# Altium schematic sheet PR2019-DataAcquisitionSystem.SchDoc: DataAcqisitionSystem
size A4; Organization: Chesi; Address1: Via Livorno, 23; Address2: 53036 Poggibonsi (SI)  - ITALY -; Address3: e-mail : andrea.chesi2000@gmail.com; DocumentNumber: 1; Revision: Rev 1.0; SheetNumber: 1; SheetTotal: 1
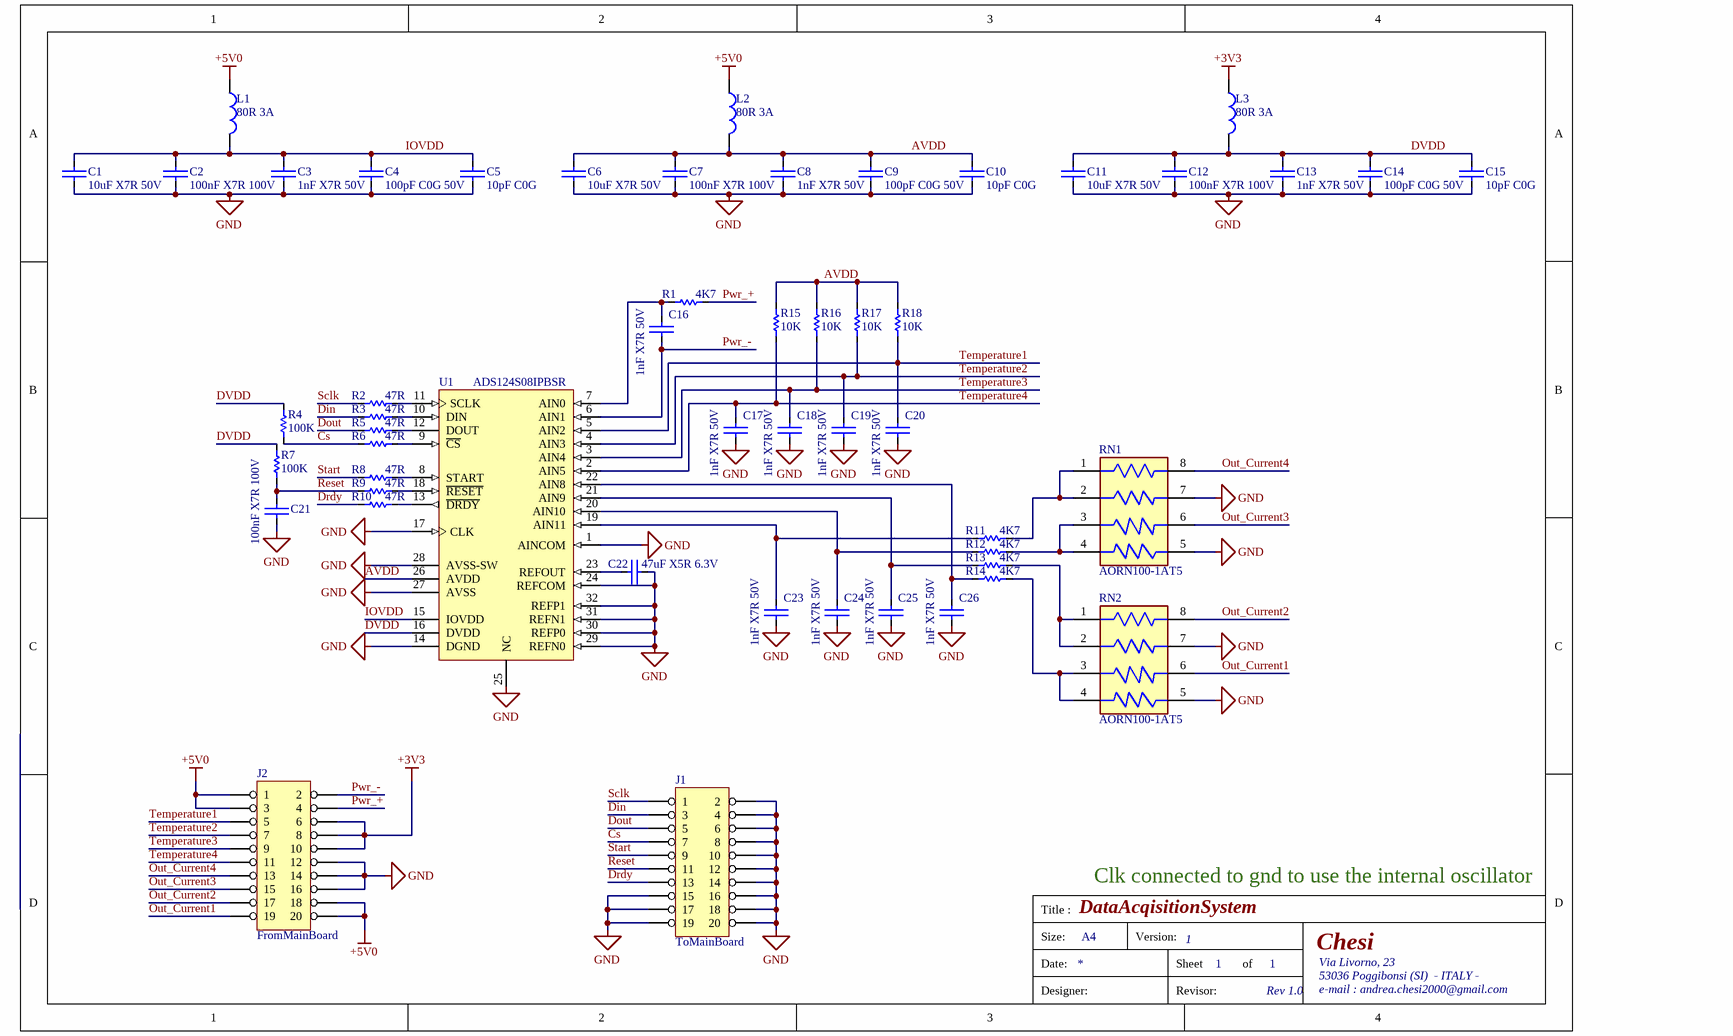
[diagram p0: PR2019-DataAcquisitionSystem.SchDoc]

## Parts
C1  10uF X7R 50V  [1206]
C2  100nF X7R 100V  [0805]
C3  1nF X7R 50V  [0805]
C4  100pF C0G 50V  [0805]
C5  10pF C0G  [0805]
C6  10uF X7R 50V  [1206]
C7  100nF X7R 100V  [0805]
C8  1nF X7R 50V  [0805]
C9  100pF C0G 50V  [0805]
C10  10pF C0G  [0805]
C11  10uF X7R 50V  [1206]
C12  100nF X7R 100V  [0805]
C13  1nF X7R 50V  [0805]
C14  100pF C0G 50V  [0805]
C15  10pF C0G  [0805]
C16  1nF X7R 50V  [0805]
C17  1nF X7R 50V  [0805]
C18  1nF X7R 50V  [0805]
C19  1nF X7R 50V  [0805]
C20  1nF X7R 50V  [0805]
C21  100nF X7R 100V  [0805]
C22  47uF X5R 6.3V  [0805]
C23  1nF X7R 50V  [0805]
C24  1nF X7R 50V  [0805]
C25  1nF X7R 50V  [0805]
C26  1nF X7R 50V  [0805]
J1  ToMainBoard  [IDC-20]
J2  FromMainBoard  [IDC-20]
L1  80R 3A  [1206]
L2  80R 3A  [1206]
L3  80R 3A  [1206]
R1  4K7  [0805]
R2  47R  [0805]
R3  47R  [0805]
R4  100K  [0805]
R5  47R  [0805]
R6  47R  [0805]
R7  100K  [0805]
R8  47R  [0805]
R9  47R  [0805]
R10  47R  [0805]
R11  4K7  [0805]
R12  4K7  [0805]
R13  4K7  [0805]
R14  4K7  [0805]
R15  10K  [0805]
R16  10K  [0805]
R17  10K  [0805]
R18  10K  [0805]
RN1  AORN100-1AT5  [FP-AORN100-1AT5-IPC_C]
RN2  AORN100-1AT5  [FP-AORN100-1AT5-IPC_C]
U1  ADS124S08IPBSR  [LQFP-32_N]

## Nets
+3V3: J2.6 J2.8 J2.10 L3.1
+5V0: J2.1 J2.3 J2.18 J2.20 L1.1 L2.1
GND: C1.2 C2.2 C3.2 C4.2 C5.2 C6.2 C7.2 C8.2 C9.2 C10.2 C11.2 C12.2 C13.2 C14.2 C15.2 C17.2 C18.2 C19.2 C20.2 C21.2 C22.2 C23.2 C24.2 C25.2 C26.2 J1.2 J1.4 J1.6 J1.8 J1.10 J1.12 J1.14 J1.15 J1.16 J1.17 J1.18 J1.19 J1.20 J2.12 J2.14 J2.16 RN1.5 RN1.7 RN2.5 RN2.7 U1.1(AINCOM) U1.14(DGND) U1.17(CLK) U1.24(REFCOM) U1.25(NC) U1.27(AVSS) U1.28(AVSS-SW) U1.29(REFN0) U1.30(REFP0) U1.31(REFN1) U1.32(REFP1)
AVDD: C6.1 C7.1 C8.1 C9.1 C10.1 L2.2 R15.1 R16.1 R17.1 R18.1 U1.26(AVDD)
Cs: J1.7 R4.2 R6.2
Din: J1.3 R3.2
Dout: J1.5 R5.2
Drdy: J1.13 R10.2
DVDD: C11.1 C12.1 C13.1 C14.1 C15.1 L3.2 R4.1 R7.1 U1.16(DVDD)
IOVDD: C1.1 C2.1 C3.1 C4.1 C5.1 L1.2 U1.15(IOVDD)
Out_Current1: J2.19 RN2.6
Out_Current2: J2.17 RN2.8
Out_Current3: J2.15 RN1.6
Out_Current4: J2.13 RN1.8
Pwr_+: J2.4 R1.1
Pwr_-: C16.2 J2.2 U1.6(AIN1)
Reset: C21.1 J1.11 R7.2 R9.2
Sclk: J1.1 R2.2
Start: J1.9 R8.2
Temperature1: C20.1 J2.5 R18.2 U1.5(AIN2)
Temperature2: C19.1 J2.7 R17.2 U1.4(AIN3)
Temperature3: C18.1 J2.9 R16.2 U1.3(AIN4)
Temperature4: C17.1 J2.11 R15.2 U1.2(AIN5)
NetC16_1: C16.1 R1.2 U1.7(AIN0)
NetC22_1: C22.1 U1.23(REFOUT)
NetC23_1: C23.1 R11.2 U1.19(AIN11)
NetC24_1: C24.1 R12.2 U1.20(AIN10)
NetC25_1: C25.1 R13.2 U1.21(AIN9)
NetC26_1: C26.1 R14.2 U1.22(AIN8)
NetR2_1: R2.1 U1.11(SCLK)
NetR3_1: R3.1 U1.10(DIN)
NetR5_1: R5.1 U1.12(DOUT)
NetR6_1: R6.1 U1.9(~{CS})
NetR8_1: R8.1 U1.8(START)
NetR9_1: R9.1 U1.18(~{RESET})
NetR10_1: R10.1 U1.13(~{DRDY})
NetR11_1: R11.1 RN1.1 RN1.2
NetR12_1: R12.1 RN1.3 RN1.4
NetR13_1: R13.1 RN2.1 RN2.2
NetR14_1: R14.1 RN2.3 RN2.4

## Notes on the sheet
- Clk connected to gnd to use the internal oscillator
- Title :
- Size:
- Date:
- A4
- Version:
- Sheet
- of
- Designer:
- Revisor:

## Library data of the parts
C1 C6 C11 = CAP_10uF X7R 50V_1206: Capacità; ArSilicii Part Number: CPC0232011; Manufacturer Part Number: CL31B106KBHNNNE; SMD/TH: SMD; 1 Supplier: ARROW ELECTRONICS ITALIA S.R.L.; 1 Supplier Part Number: CL31B106KBHNNNE; 1 Supplier Unit Price: *; 2 Supplier: *; 2 Supplier Part Number: *; 2 Supplier Unit Price: *; 3 Supplier: *; 3 Supplier Part Number: *; 3 Supplier Unit Price: *; Manufacturer: *; ComponentLink1URL: *; ComponentLink2URL: *; ComponentLink1Description: Datasheet for 10uF X7R 25V; ComponentLink2Description: *; HelpURL: *
C2 C7 C12 C21 = CAP_100nF X7R 100V_0805: Capacità; ArSilicii Part Number: CPC0213101; Manufacturer: SAMSUNG; Manufacturer Part Number: CL21B104KCFSFNG; SMD/TH: SMD; 1 Supplier: ARROW ELECTRONICS ITALIA S.R.L.; 1 Supplier Part Number: CL21B104KCFSFNG; 1 Supplier Unit Price: *; 2 Supplier: FARNELL ITALIA S.R.L.; 2 Supplier Part Number: 1907331; 2 Supplier Unit Price: *; 3 Supplier: *; 3 Supplier Part Number: *; 3 Supplier Unit Price: *; ComponentLink1URL: *; ComponentLink2URL: *; ComponentLink1Description: *; ComponentLink2Description: *; HelpURL: *
C3 C8 C13 C16-C20 C23-C26 = CAP_1nF X7R 50V_0805: Capacità; ArSilicii Part Number: CPC0213001; Manufacturer: EPCOS / TDK; Manufacturer Part Number: B37941K5102K60; SMD/TH: SMD; 1 Supplier: DISTAR S.R.L.; 1 Supplier Part Number: B37941K5102K60; 1 Supplier Unit Price: 0,00235; 2 Supplier: ARROW ELECTRONICS ITALIA S.R.L.; 2 Supplier Part Number: 0805B102K5CT; 2 Supplier Unit Price: *; 3 Supplier: *; 3 Supplier Part Number: *; 3 Supplier Unit Price: *; ComponentLink1URL: *; ComponentLink2URL: *; ComponentLink1Description: *; ComponentLink2Description: *; HelpURL: *
C4 C9 C14 = CAP_100pF C0G 50V_0805: Capacità; ArSilicii Part Number: CPC0614100; Manufacturer: YAGEO; Manufacturer Part Number: CC0805JRNPO9BN101; SMD/TH: SMD; 1 Supplier: ARROW ELECTRONICS ITALIA S.R.L.; 1 Supplier Part Number: CC0805JRNPO9BN101; 1 Supplier Unit Price: 0,09; 2 Supplier: *; 2 Supplier Part Number: *; 2 Supplier Unit Price: *; 3 Supplier: *; 3 Supplier Part Number: *; 3 Supplier Unit Price: *; ComponentLink1URL: *; ComponentLink2URL: *; ComponentLink1Description: *; ComponentLink2Description: *; HelpURL: *
C5 C10 C15 = CAP_10pF C0G_0805: Capacità; ArSilicii Part Number: CPC0614010; SMD/TH: SMD; 1 Supplier: *; 1 Supplier Part Number: *; 1 Supplier Unit Price: 0,09; 2 Supplier: *; 2 Supplier Part Number: *; 2 Supplier Unit Price: *; 3 Supplier: *; 3 Supplier Part Number: *; 3 Supplier Unit Price: *; Manufacturer: *; Manufacturer Part Number: *; ComponentLink1URL: *; ComponentLink2URL: *; ComponentLink1Description: *; ComponentLink2Description: *; HelpURL: *
C22 = CAP_47uF X5R 6.3V_0805: Capacità; Manufacturer: Murata Electronics; Manufacturer Part Number: GRM21BR60J476ME15L; SMD/TH: SMD; 1 Supplier: MOUSER; 1 Supplier Part Number: 81-GRM21BR60J476ME5L; 1 Supplier Unit Price: 0,161; 2 Supplier: RS; 2 Supplier Part Number: 846-7322; 2 Supplier Unit Price: 0,176; 3 Supplier: *; 3 Supplier Part Number: *; 3 Supplier Unit Price: *; ArSilicii Part Number: *; ComponentLink1URL: http://www.mouser.com/ds/2/281/c02e-2905.pdf; ComponentLink2URL: *; ComponentLink1Description: Datasheet; ComponentLink2Description: *; HelpURL: *; Supplier 1: Mouser; Supplier Part Number 1: 81-GRM21BR60J476ME5L; Supplier 2: Digi-Key; Supplier Part Number 2: 490-9960-1-ND
J1 J2 = HEADER 10X2: System: Connector; SMD/TH: TH; 1 Supplier: *; 1 Supplier Part Number: *; 1 Supplier Unit Price: *; 2 Supplier: *; 2 Supplier Part Number: *; 2 Supplier Unit Price: *; 3 Supplier: *; 3 Supplier Part Number: *; 3 Supplier Unit Price: *; ArSilicii Part Number: *; Manufacturer: *; Manufacturer Part Number: *; ComponentLink1URL: *; ComponentLink2URL: *; ComponentLink1Description: *; ComponentLink2Description: *
L1-L3 = Ferrite 80R 3A: Ferrite; ArSilicii Part Number: CPF0006000; Manufacturer: Wurth Elektronik; Manufacturer Part Number: 74279215; SMD/TH: SMD; 1 Supplier: RS COMPONENTS S.P.A.; 1 Supplier Part Number: 3275550P; 1 Supplier Unit Price: 0,21000; 2 Supplier: *; 2 Supplier Part Number: *; 2 Supplier Unit Price: *; 3 Supplier: *; 3 Supplier Part Number: *; 3 Supplier Unit Price: *; ComponentLink1URL: http://docs-europe.electrocomponents.com/webdocs/0033/0900766b80033a26.pdf; ComponentLink2URL: *; ComponentLink1Description: Datasheet for Ferrite 80R 3A; ComponentLink2Description: *; HelpURL: *; Supplier 1: Digi-Key; Supplier Part Number 1: 732-1629-1-ND
R1-R18 = RES_SMD: Resistenza; SMD/TH: SMD; 1 Supplier: *; 1 Supplier Part Number: *; 1 Supplier Unit Price: *; 2 Supplier: *; 2 Supplier Part Number: *; 2 Supplier Unit Price: *; 3 Supplier: *; 3 Supplier Part Number: *; 3 Supplier Unit Price: *; ArSilicii Part Number: *; Manufacturer: *; Manufacturer Part Number: *; ComponentLink1URL: *; ComponentLink2URL: *; ComponentLink1Description: *; ComponentLink2Description: *; HelpURL: *
RN1 RN2 = CMP-02406-000003-1: RES NETWORK 4 RES MULT OHM 8SOIC; Manufacturer: Vishay; Resistance: 1/100kΩ; Standoff Height: 0.1524mm; Temperature Coefficient: 25ppm/°C; Automotive Grade: Grade 0; Tolerance: 0.1%; Number Of Resistors: 4; Value: 1/100kΩ; Power Per Resistor: 100mW; Power Rating: 400mW; Lead Free: Yes; Package: AORN100-1AT5; Manufacturer Part Number: AORN100-1AT5; Category: Res; Temperature Range High: +155°C; Device Class L3: Resistor Arrays; Automotive: Yes; Temperature: -55°C to +155°C; Termination: Gull-Wing; Ipc Land Pattern Name: SOIC127P607X173-8; Device Class L1: Passive Components; Series: AORN; Octopart: https://octopart.com/aorn1001at5-vishay-54384707; ComponentLink2Description: Datasheet; Digikey Description: RES NETWORK 4 RES MULT OHM 8SOIC; Composition: Thin Film; Device Class L2: Resistors; ComponentLink2URL: https://www.vishay.com/docs/60127/aorn.pdf; RoHS: TRUE; Temperature Range Low: -55°C; Height: 1.73mm